# Altium project P-MT3620RDB-1-7.PrjPcb (part 3 of 5)
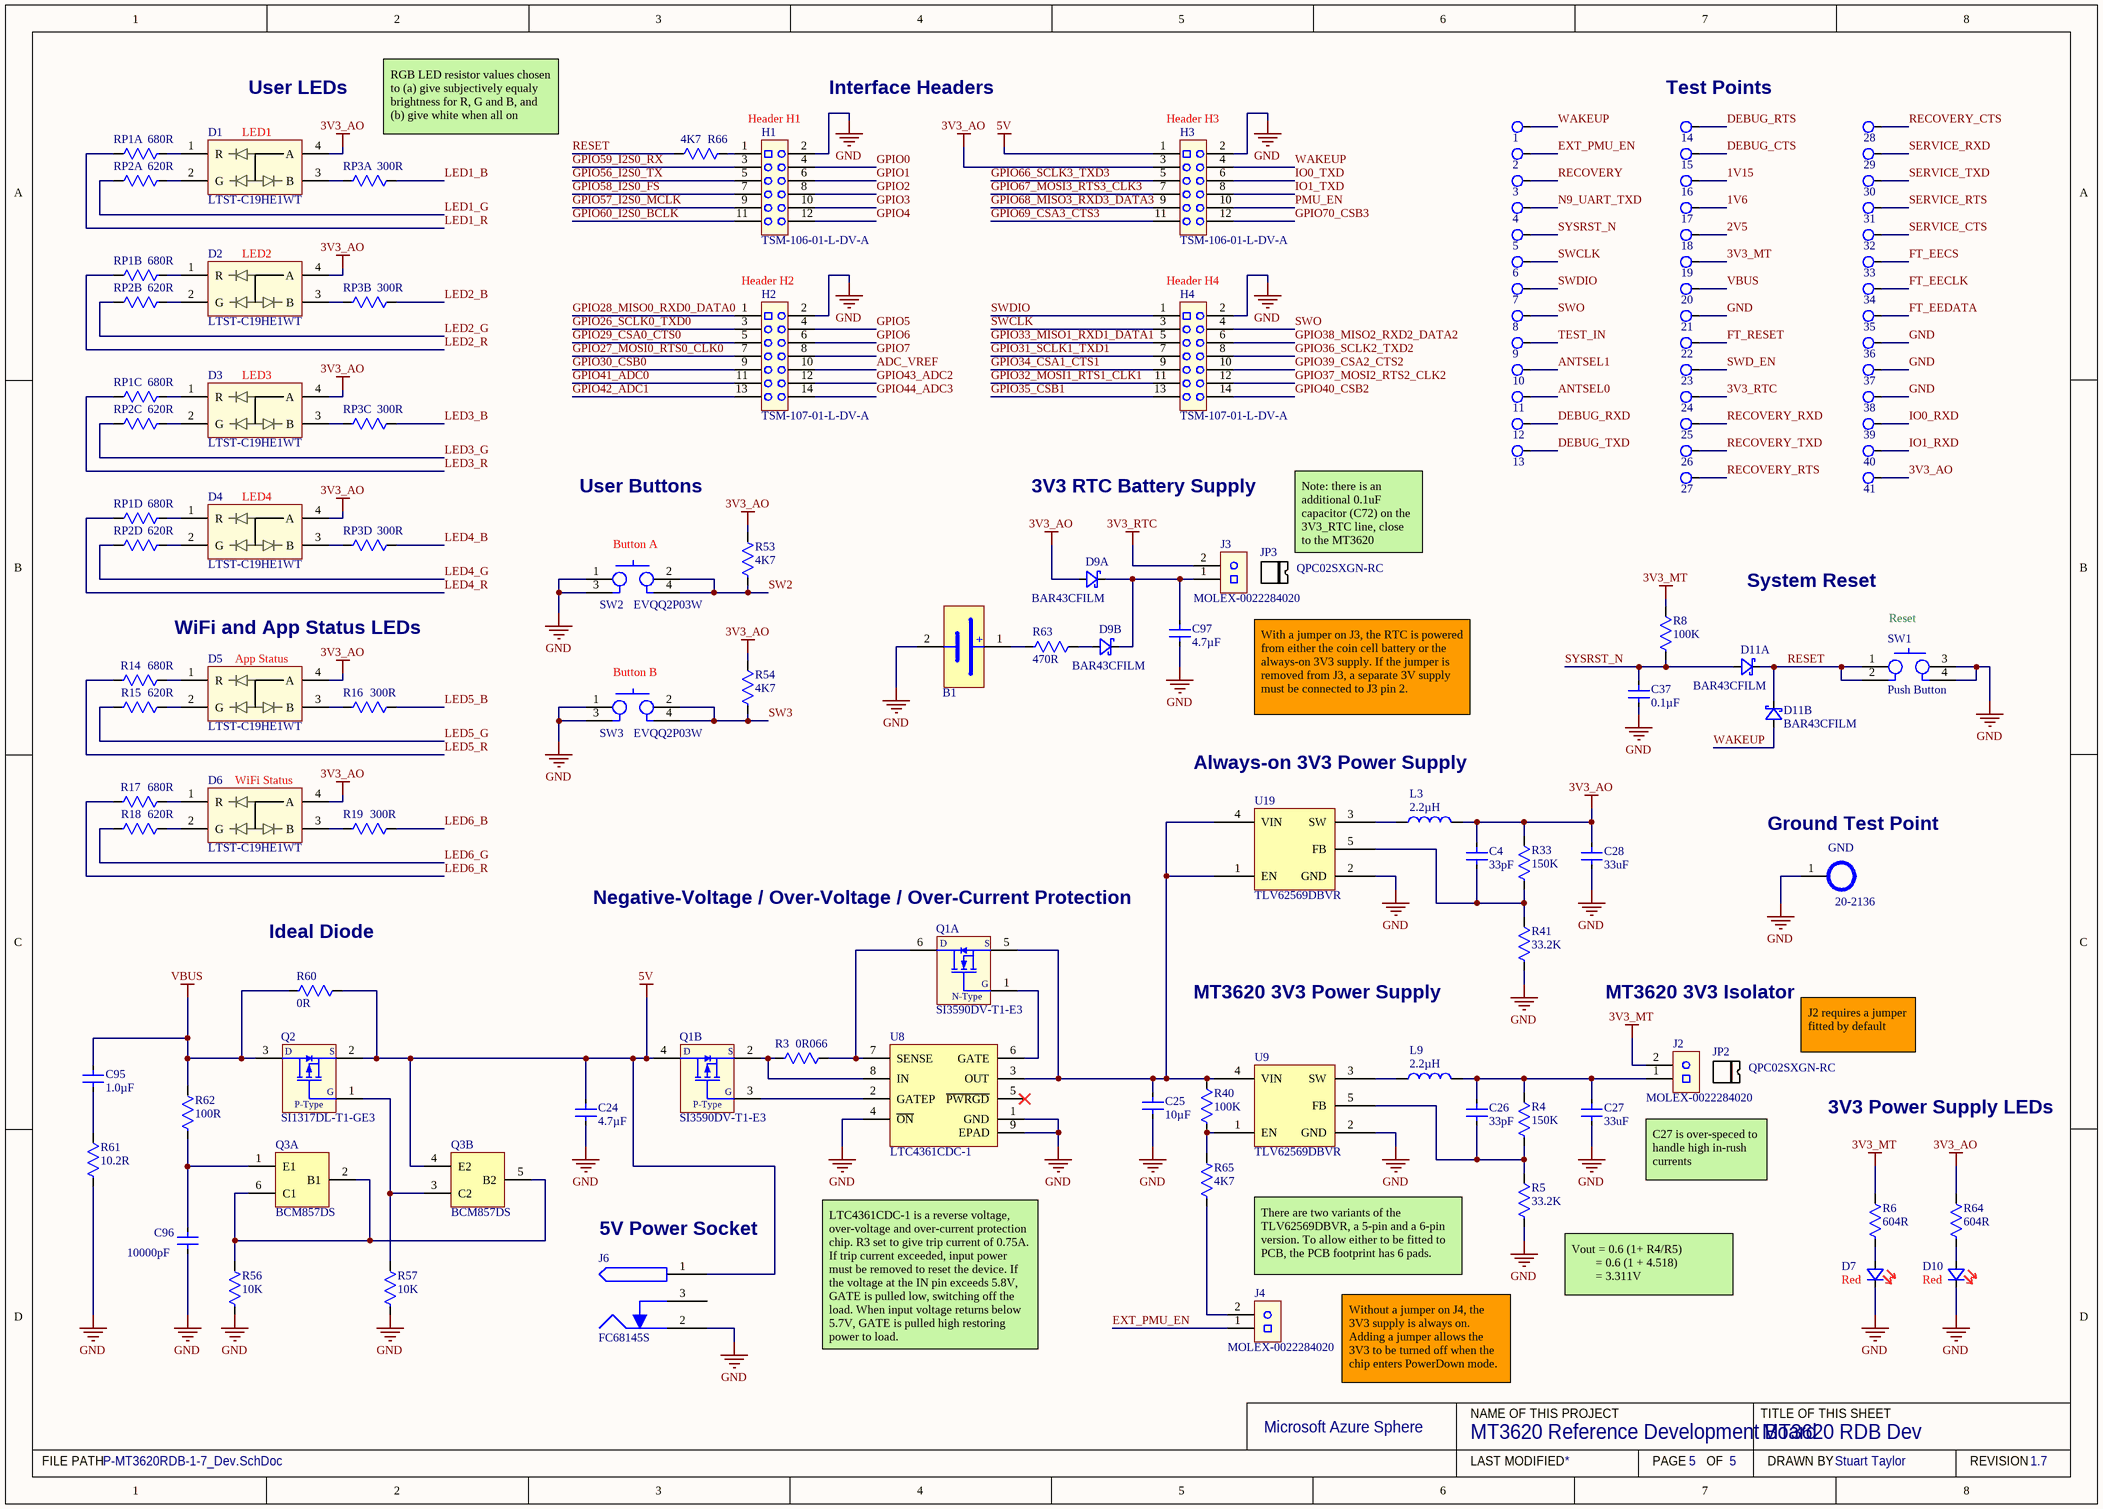
[diagram p5: P-MT3620RDB-1-7_Dev.SchDoc]

## Sheet P-MT3620RDB-1-7_Dev.SchDoc: MT3620 RDB Dev (continued)

### Notes on the sheet
- User LEDs
- Interface Headers
- (near 14) Test Points
- (near D1) LED1
- (near RP3) RGB LED resistor values chosen to (a) give subjectively equaly brightness for R, G and B, and (b) give white when all on
- Header H1
- (near H3) Header H3
- (near D2) LED2
- (near H2) Header H2
- (near H4) Header H4
- (near D3) LED3
- (near D4) LED4
- User Buttons
- 3V3 RTC Battery Supply
- (near SW2) Button A
- (near JP3) Note: there is an additional 0.1uF capacitor (C72) on the 3V3_RTC line, close to the MT3620
- System Reset
- WiFi and App Status LEDs
- (near SW1) Reset
- (near D5) App Status
- (near SW3) Button B
- With a jumper on J3, the RTC is powered from either the coin cell battery or the always-on 3V3 supply. If the jumper is removed from J3, a separate 3V supply must be connected to J3 pin 2.
- (near D6) WiFi Status
- Always-on 3V3 Power Supply
- (near GND) Ground Test Point
- (near Q1) Negative-Voltage / Over-Voltage / Over-Current Protection
- (near R60) Ideal Diode
- MT3620 3V3 Power Supply
- MT3620 3V3 Isolator
- J2 requires a jumper fitted by default
- 3V3 Power Supply LEDs
- C27 is over-speced to handle high in-rush currents
- (near J6) 5V Power Socket
- There are two variants of the TLV62569DBVR, a 5-pin and a 6-pin version. To allow either to be fitted to PCB, the PCB footprint has 6 pads.
- (near R5) Vout = 0.6 (1+ R4/R5)
  = 0.6 (1 + 4.518)
  = 3.311V
- LTC4361CDC-1 is a reverse voltage, over-voltage and over-current protection chip. R3 set to give trip current of 0.75A. If trip current exceeded, input power must be removed to reset the device. If the voltage at the IN pin exceeds 5.8V, GATE is pulled low, switching off the load. When input voltage returns below 5.7V, GATE is pulled high restoring power to load.
- Without a jumper on J4, the 3V3 supply is always on. Adding a jumper allows the 3V3 to be turned off when the chip enters PowerDown mode.
- Microsoft Azure Sphere
- NAME OF THIS PROJECT
- TITLE OF THIS SHEET
- FILE PATH
- LAST MODIFIED
- PAGE
- OF
- DRAWN BY
- REVISION
- (in symbol SI1317DL-T1-GE3) P-Type
- (in symbol SI3590DV-T1-E3, part A) D; S; G; N-Type
- (in symbol SI3590DV-T1-E3, part B) D; S; G; P-Type